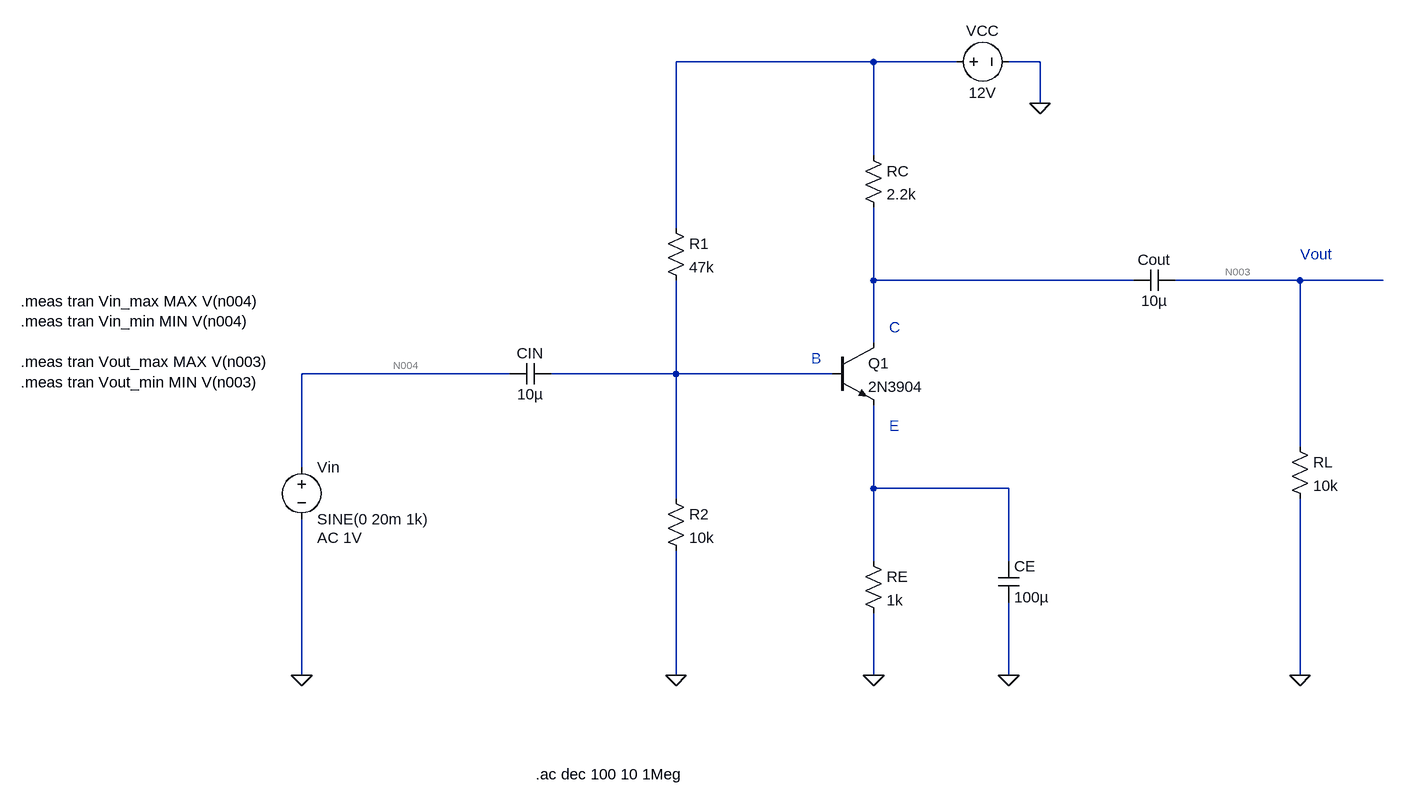
[diagram p0: schematic CE_BJT_Amplifier.asc]
CE_BJT_Amplifier.asc, the LTspice schematic file:
Version 4.1
SHEET 1 1764 680
WIRE 976 -480 672 -480
WIRE 1104 -480 976 -480
WIRE 1232 -480 1184 -480
WIRE 1232 -416 1232 -480
WIRE 976 -336 976 -480
WIRE 672 -224 672 -480
WIRE 976 -144 976 -256
WIRE 1376 -144 976 -144
WIRE 1632 -144 1440 -144
WIRE 1760 -144 1632 -144
WIRE 976 -48 976 -144
WIRE 416 0 96 0
WIRE 672 0 672 -144
WIRE 672 0 480 0
WIRE 912 0 672 0
WIRE 1632 112 1632 -144
WIRE 96 144 96 0
WIRE 976 176 976 48
WIRE 1184 176 976 176
WIRE 672 192 672 0
WIRE 976 288 976 176
WIRE 1184 288 1184 176
WIRE 96 464 96 224
WIRE 672 464 672 272
WIRE 976 464 976 368
WIRE 1184 464 1184 352
WIRE 1632 464 1632 192
FLAG 976 464 0
FLAG 672 464 0
FLAG 96 464 0
FLAG 1184 464 0
FLAG 1632 464 0
FLAG 1232 -416 0
SYMBOL voltage 96 128 R0
WINDOW 123 24 124 Left 2
WINDOW 39 0 0 Left 0
SYMATTR InstName Vin
SYMATTR Value SINE(0 20m 1k)
SYMATTR Value2 AC 1V
SYMBOL cap 480 -16 R90
WINDOW 0 0 32 VBottom 2
WINDOW 3 32 32 VTop 2
SYMATTR InstName CIN
SYMATTR Value 10µ
SYMBOL res 656 -240 R0
SYMATTR InstName R1
SYMATTR Value 47k
SYMBOL res 656 176 R0
SYMATTR InstName R2
SYMATTR Value 10k
SYMBOL npn 912 -48 R0
SYMATTR InstName Q1
SYMATTR Value 2N3904
SYMBOL res 960 -352 R0
SYMATTR InstName RC
SYMATTR Value 2.2k
SYMBOL res 960 272 R0
SYMATTR InstName RE
SYMATTR Value 1k
SYMBOL cap 1440 -160 R90
WINDOW 0 0 32 VBottom 2
WINDOW 3 32 32 VTop 2
SYMATTR InstName Cout
SYMATTR Value 10µ
SYMBOL cap 1168 288 R0
SYMATTR InstName CE
SYMATTR Value 100µ
SYMBOL res 1616 96 R0
SYMATTR InstName RL
SYMATTR Value 10k
SYMBOL voltage 1088 -480 R270
WINDOW 0 32 56 VTop 2
WINDOW 3 -32 56 VBottom 2
SYMATTR InstName VCC
SYMATTR Value 12V
TEXT 880 -24 Left 2 ;B
TEXT 1000 80 Left 2 ;E
TEXT 1000 -72 Left 2 ;C
TEXT 1632 -184 Left 2 ;Vout
TEXT -336 -112 Left 2 !.meas tran Vin_max MAX V(n004)\n.meas tran Vin_min MIN V(n004)\n \n.meas tran Vout_max MAX V(n003)\n.meas tran Vout_min MIN V(n003)
TEXT 456 616 Left 2 !.ac dec 100 10 1Meg

The netlist it stands for:
* CE_BJT_Amplifier.asc
Vin N004 0 SINE(0 20m 1k) AC 1V
CIN N005 N004 10µ
R1 N001 N005 47k
R2 N005 0 10k
Q1 N002 N005 N006 0 2N3904
RC N001 N002 2.2k
RE N006 0 1k
Cout N003 N002 10µ
CE N006 0 100µ
RL N003 0 10k
VCC N001 0 12V
.model NPN NPN
.model PNP PNP
.lib standard.bjt
* B
* E
* C
* Vout
.meas tran Vin_max MAX V(n004)
.meas tran Vin_min MIN V(n004)
.meas tran Vout_max MAX V(n003)
.meas tran Vout_min MIN V(n003)
.ac dec 100 10 1Meg
.backanno
.end